# EAGLE schematic NusbioMCU_NeoPixels (EAGLE 7.6.0)
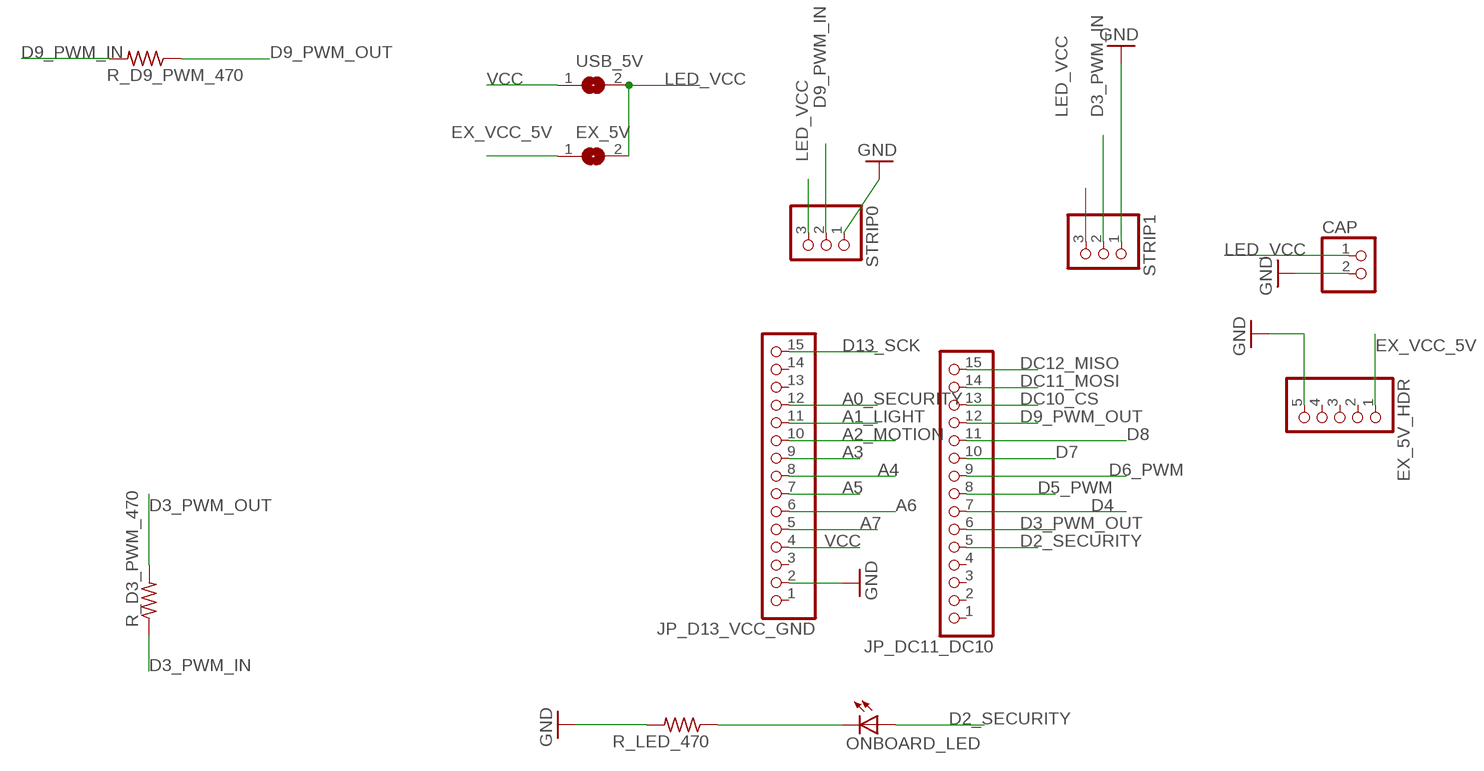
[diagram p0: schematic, sheet 1]

## Parts
CAP  PINHD-1X2  [1X02]
EX_5V  SOLDERJUMPERREFLOW  [SOLDERJUMPER_REFLOW]
EX_5V_HDR  PINHD-1X5  [1X05]
JP_D13_VCC_GND  PINHD-1X15  [1X15]
JP_DC11_DC10  PINHD-1X15  [1X15]
ONBOARD_LED  LEDSMT1206  [1206]
R_D3_PWM_470  R-US_R1206  [R1206]
R_D9_PWM_470  R-US_R1206  [R1206]
R_LED_470  R-US_R1206  [R1206]
STRIP0  PINHD-1X3  [1X03]
STRIP1  PINHD-1X3  [1X03]
USB_5V  SOLDERJUMPERREFLOW  [SOLDERJUMPER_REFLOW]

## Nets
A0_SECURITY: JP_D13_VCC_GND.12
A1_LIGHT: JP_D13_VCC_GND.11
A2_MOTION: JP_D13_VCC_GND.10
A3: JP_D13_VCC_GND.9
A4: JP_D13_VCC_GND.8
A5: JP_D13_VCC_GND.7
A6: JP_D13_VCC_GND.6
A7: JP_D13_VCC_GND.5
D2_SECURITY: JP_DC11_DC10.5 ONBOARD_LED.A
D3_PWM_IN: R_D3_PWM_470.1 STRIP1.2
D3_PWM_OUT: JP_DC11_DC10.6 R_D3_PWM_470.2
D4: JP_DC11_DC10.7
D5_PWM: JP_DC11_DC10.8
D6_PWM: JP_DC11_DC10.9
D7: JP_DC11_DC10.10
D8: JP_DC11_DC10.11
D9_PWM_IN: R_D9_PWM_470.2 STRIP0.2
D9_PWM_OUT: JP_DC11_DC10.12 R_D9_PWM_470.1
D13_SCK: JP_D13_VCC_GND.15
DC10_CS: JP_DC11_DC10.13
DC11_MOSI: JP_DC11_DC10.14
DC12_MISO: JP_DC11_DC10.15
EX_VCC_5V: EX_5V.1 EX_5V_HDR.1
GND: CAP.2 EX_5V_HDR.5 JP_D13_VCC_GND.2 R_LED_470.2 STRIP0.1 STRIP1.1
LED_VCC: CAP.1 EX_5V.2 STRIP0.3 STRIP1.3 USB_5V.2
N$1: ONBOARD_LED.C R_LED_470.1
VCC: JP_D13_VCC_GND.4 USB_5V.1
Unconnected: EX_5V_HDR.2 EX_5V_HDR.3 EX_5V_HDR.4 JP_D13_VCC_GND.1 JP_D13_VCC_GND.3 JP_D13_VCC_GND.13 JP_D13_VCC_GND.14 JP_DC11_DC10.1 JP_DC11_DC10.2 JP_DC11_DC10.3 JP_DC11_DC10.4

## Library data of the parts
CAP = pinhead:PINHD-1X2: PIN HEADER
EX_5V USB_5V = microbuilder:SOLDERJUMPER: SMD Solder JUMPER Solder the two pads together to create a connection, or remove the solder to break it. REFLOW - Use this footprint for solder paste and reflow ovens. WAVE - Use this footprint for hand-soldering (larger pads). CLOSED - Has a trace between the two pads to ensure it is closed by default. The trace needs to be cut to disable the jumper, and can be closed again by creating a solder bridge between the two pads.
EX_5V_HDR = pinhead:PINHD-1X5: PIN HEADER
JP_D13_VCC_GND JP_DC11_DC10 = adafruit:PINHD-1X15: PIN HEADER
ONBOARD_LED = adafruit:LED: LED OSRAM: - CHIPLED LG R971, LG N971, LY N971, LG Q971, LY Q971, LO R971, LY R971 LH N974, LH R974 LS Q976, LO Q976, LY Q976 LO Q996 - Hyper CHIPLED LW Q18S LB Q993, LB Q99A, LB R99A - SideLED LS A670, LO A670, LY A670, LG A670, LP A670 LB A673, LV A673, LT A673, LW A673 LH A674 LY A675 LS A676, LA A676, LO A676, LY A676, LW A676 LS A679, LY A679, LG A679 - Hyper Micro SIDELED® LS Y876, LA Y876, LO Y876, LY Y876 LT Y87S - SmartLED LW L88C, LW L88S LB L89C, LB L89S, LG L890 LS L89K, LO L89K, LY L89K LS L896, LA L896, LO L896, LY L896 - TOPLED LS T670, LO T670, LY T670, LG T670, LP T670 LSG T670, LSP T670, LSY T670, LOP T670, LYG T670 LG T671, LOG T671, LSG T671 LB T673, LV T673, LT T673, LW T673 LH T674 LS T676, LA T676, LO T676, LY T676, LB T676, LH T676, LSB T676, LW T676 LB T67C, LV T67C, LT T67C, LS T67K, LO T67K, LY T67K, LW E67C LS E67B, LA E67B, LO E67B, LY E67B, LB E67C, LV E67C, LT E67C LW T67C LS T679, LY T679, LG T679 LS T770, LO T770, LY T770, LG T770, LP T770 LB T773, LV T773, LT T773, LW T773 LH T774 LS E675, LA E675, LY E675, LS T675 LS T776, LA T776, LO T776, LY T776, LB T776 LHGB T686 LT T68C, LB T68C - Hyper Mini TOPLED® LB M676 - Mini TOPLED Santana® LG M470 LS M47K, LO M47K, LY M47K Source: http://www.osram.convergy.de/
R_D3_PWM_470 R_D9_PWM_470 R_LED_470 = adafruit:R-US_: RESISTOR, American symbol
STRIP0 STRIP1 = adafruit:PINHD-1X3: PIN HEADER